# Altium project main.PrjPCB (part 2 of 2)

## Sheet sensors_in.SchDoc
size A4
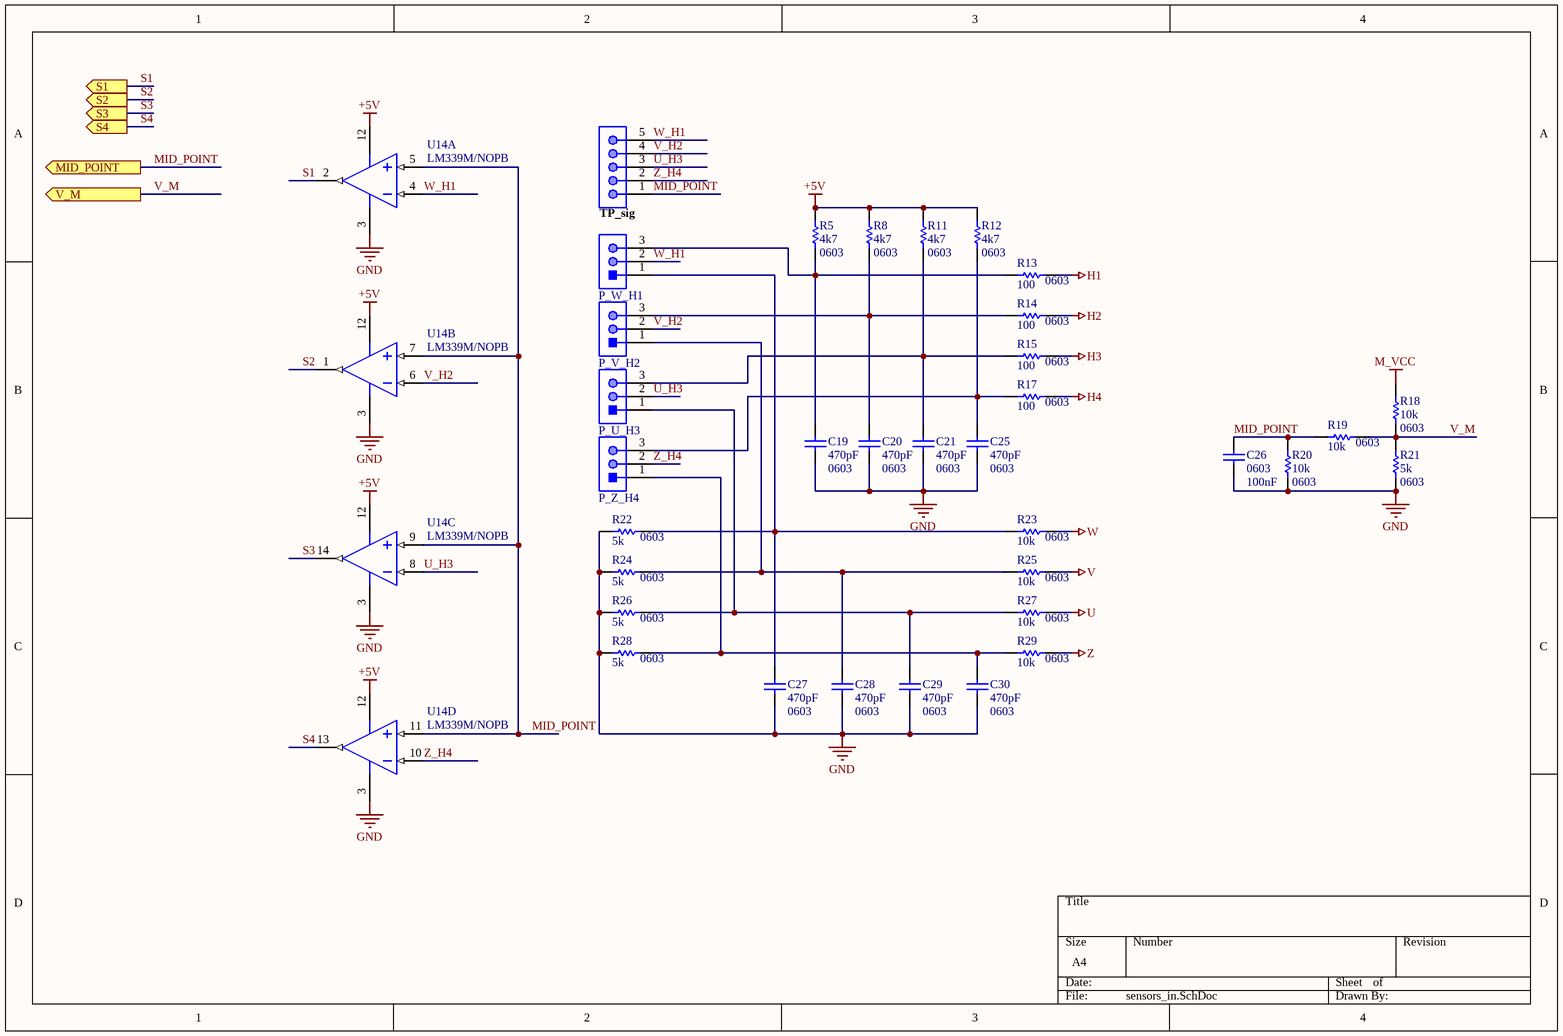
[diagram p5: sensors_in.SchDoc]

### Parts
C19  value 470pF  Case-EIA: 0603  [CAPC0603(1608)100_M]  (hidden comment: CAP 470pF 25V 0603(1608))
C20  value 470pF  Case-EIA: 0603  [CAPC0603(1608)100_M]  (hidden comment: CAP 470pF 25V 0603(1608))
C21  value 470pF  Case-EIA: 0603  [CAPC0603(1608)100_M]  (hidden comment: CAP 470pF 25V 0603(1608))
C25  value 470pF  Case-EIA: 0603  [CAPC0603(1608)100_M]  (hidden comment: CAP 470pF 25V 0603(1608))
C26  Case Code (Imperial): 0603  Capacitance: 100nF  [CAPC1608X90X35ML10T15]  (hidden comment: GRM188R71H104KA93D)
C27  value 470pF  Case-EIA: 0603  [CAPC0603(1608)100_M]  (hidden comment: CAP 470pF 25V 0603(1608))
C28  value 470pF  Case-EIA: 0603  [CAPC0603(1608)100_M]  (hidden comment: CAP 470pF 25V 0603(1608))
C29  value 470pF  Case-EIA: 0603  [CAPC0603(1608)100_M]  (hidden comment: CAP 470pF 25V 0603(1608))
C30  value 470pF  Case-EIA: 0603  [CAPC0603(1608)100_M]  (hidden comment: CAP 470pF 25V 0603(1608))
P_U_H3  61300311121  [61300311121]  (value not drawn)
P_V_H2  61300311121  [61300311121]  (value not drawn)
P_W_H1  61300311121  [61300311121]  (value not drawn)
P_Z_H4  61300311121  [61300311121]  (value not drawn)
R5  Resistance (Ohms): 4k7  Package Reference: 0603  [RESC1608X55X30ML15T20]  (hidden comment: RMCF0603FT10K0)
R8  Resistance (Ohms): 4k7  Package Reference: 0603  [RESC1608X55X30ML15T20]  (hidden comment: RMCF0603FT10K0)
R11  Resistance (Ohms): 4k7  Package Reference: 0603  [RESC1608X55X30ML15T20]  (hidden comment: RMCF0603FT10K0)
R12  Resistance (Ohms): 4k7  Package Reference: 0603  [RESC1608X55X30ML15T20]  (hidden comment: RMCF0603FT10K0)
R13  Resistance (Ohms): 100  Package Reference: 0603  [RESC1608X55X30ML15T20]  (hidden comment: RMCF0603FT10K0)
R14  Resistance (Ohms): 100  Package Reference: 0603  [RESC1608X55X30ML15T20]  (hidden comment: RMCF0603FT10K0)
R15  Resistance (Ohms): 100  Package Reference: 0603  [RESC1608X55X30ML15T20]  (hidden comment: RMCF0603FT10K0)
R17  Resistance (Ohms): 100  Package Reference: 0603  [RESC1608X55X30ML15T20]  (hidden comment: RMCF0603FT10K0)
R18  Resistance (Ohms): 10k  Package Reference: 0603  [RESC1608X55X30ML15T20]  (hidden comment: RMCF0603FT10K0)
R19  Resistance (Ohms): 10k  Package Reference: 0603  [RESC1608X55X30ML15T20]  (hidden comment: RMCF0603FT10K0)
R20  Resistance (Ohms): 10k  Package Reference: 0603  [RESC1608X55X30ML15T20]  (hidden comment: RMCF0603FT10K0)
R21  Resistance (Ohms): 5k  Package Reference: 0603  [RESC1608X55X30ML15T20]  (hidden comment: RMCF0603FT10K0)
R22  Resistance (Ohms): 5k  Package Reference: 0603  [RESC1608X55X30ML15T20]  (hidden comment: RMCF0603FT10K0)
R23  Resistance (Ohms): 10k  Package Reference: 0603  [RESC1608X55X30ML15T20]  (hidden comment: RMCF0603FT10K0)
R24  Resistance (Ohms): 5k  Package Reference: 0603  [RESC1608X55X30ML15T20]  (hidden comment: RMCF0603FT10K0)
R25  Resistance (Ohms): 10k  Package Reference: 0603  [RESC1608X55X30ML15T20]  (hidden comment: RMCF0603FT10K0)
R26  Resistance (Ohms): 5k  Package Reference: 0603  [RESC1608X55X30ML15T20]  (hidden comment: RMCF0603FT10K0)
R27  Resistance (Ohms): 10k  Package Reference: 0603  [RESC1608X55X30ML15T20]  (hidden comment: RMCF0603FT10K0)
R28  Resistance (Ohms): 5k  Package Reference: 0603  [RESC1608X55X30ML15T20]  (hidden comment: RMCF0603FT10K0)
R29  Resistance (Ohms): 10k  Package Reference: 0603  [RESC1608X55X30ML15T20]  (hidden comment: RMCF0603FT10K0)
TP_sig  PH2541-5-SPGRH-6-3  [PH2541-5-SPGRH-6-3_V]  (value not drawn)
U14  LM339M/NOPB  [D0014A_L]  (parts A,B,C,D of 4)

### Ports
MID_POINT (out), S1 (out), S2 (out), S3 (out), S4 (out), V_M (out)

### Nets
+5V: R5.2 R8.2 R11.2 R12.2 U14.12(GND)
GND: C19.1 C20.1 C21.1 C25.1 C26.1 C27.1 C28.1 C29.1 C30.1 R20.1 R21.1 R22.1 R24.1 R26.1 R28.1 U14.3(V+)
H1: R13.2
H2: R14.2
H3: R15.2
H4: R17.2
M_VCC: R18.2
U: R27.2
V: R25.2
W: R23.2
Z: R29.2
MID_POINT: C26.2 R19.1 R20.2 TP_sig.1 U14.5(IN1+) U14.7(IN2+) U14.9(IN3+) U14.11(IN4+) ; port MID_POINT
S1: U14.2(OUT1) ; port S1
S2: U14.1(OUT2) ; port S2
S3: U14.14(OUT3) ; port S3
S4: U14.13(OUT4) ; port S4
U_H3: P_U_H3.2 TP_sig.3 U14.8(IN3-)
V_H2: P_V_H2.2 TP_sig.4 U14.6(IN2-)
V_M: R18.1 R19.2 R21.2 ; port V_M
W_H1: P_W_H1.2 TP_sig.5 U14.4(IN1-)
Z_H4: P_Z_H4.2 TP_sig.2 U14.10(IN4-)
NetC19_2: C19.2 P_W_H1.3 R5.1 R13.1
NetC20_2: C20.2 P_V_H2.3 R8.1 R14.1
NetC21_2: C21.2 P_U_H3.3 R11.1 R15.1
NetC25_2: C25.2 P_Z_H4.3 R12.1 R17.1
NetC27_2: C27.2 P_W_H1.1 R22.2 R23.1
NetC28_2: C28.2 P_V_H2.1 R24.2 R25.1
NetC29_2: C29.2 P_U_H3.1 R26.2 R27.1
NetC30_2: C30.2 P_Z_H4.1 R28.2 R29.1

### Library data of the parts
C19-C21 C25 C27-C30 = CMP-1035-01670-1: CAP 470pF 25V ±5% 0603 (1608 Metric) Thickness 1mm SMD; Tolerance: Â±5%; Case-Metric: 1608; Rated Voltage: 25 V; Max Thickness: 1 mm; Technology: SMT
C26 = CMP-2100-03643-1: Chip Capacitor, 0.1 uF, +/- 10%, 50 V, -55 to 125 degC, 0603 (1608 Metric), RoHS, Tape and Reel; Manufacturer: Murata; Dielectric Material: Ceramic; Voltage Rating: 50V; Dielectric: X7R; Insulation Resistance: 10GR; Case Code (Metric): 1608; Lead Free: LeadFree; Depth: 0.8mm; Number of Pins: 2; Radiation Hardening: No; Case/Package: 0603; Manufacturer URL: http://www.murata.com/; Packaging: TapeandReel; Length: 1.6mm; Contact Plating: Tin; Datasheet URL: http://psearch.en.murata.com/capacitor/product/GRM188R71H104KA93%23.pdf; Tolerance: 10%; Min Operating Temperature: -55degC; RoHSCompliant: true; Voltage: 50V; Termination: SMD/SMT; Mount: SurfaceMount; Material: Ceramic; Package Quantity: 1; Height: 0.8mm; Thickness: 0.035inch; REACH SVHC: NoSVHC; Max Operating Temperature: 125degC; Width: 0.8mm; Package Reference: 0603; Voltage Rating (DC): 50V; Datasheet Version: 42675.0; Package Description: 2-Pin Surface Mount Device, Body 1.6 x 0.8 mm
P_U_H3 P_V_H2 P_W_H1 P_Z_H4 = CMP-1502-01062-1: THT Vertical Pin Header WR-PHD, Pitch 2.54 mm, Single Row, 3 pins; Manufacturer: Wurth Elektronik; Withstanding Voltage: 500VAC; Working Voltage: 250VAC; Rated Current: 3A; Pitch: 2.54mm; Pin Number: 3; Gender: Male; Contact Resistance: 20mOhm; Package Reference: 61300311121; Manufacturer URL: http://www.we-online.de; Datasheet URL: https://katalog.we-online.de/em/datasheet/6130xx11121.pdf; Operating Temperature: -40to105degC; Part Number: 61300311121; Orientation: Vertical; Packaging: Bag; Row Number: Single; Mounting Technology: THT; Publisher: WurthElektronik
R5 R8 R11-R15 R17-R29 = CMP-2000-06990-1: Chip Resistor, 10 KOhm, +/- 1%, 0.1 W, -55 to 155 degC, 0603 (1608 Metric), RoHS, Tape and Reel; Manufacturer: Stackpole-Electronics-Inc.; Temperature Coefficient: ±100ppm/°C; Power (Watts): 0.1W,1/10W; Package / Case: 0603(1608Metric); Datasheet Version: 01/2017; Features: AutomotiveAEC-Q200; Packaging: CutTape(CT); Series: RMCF; Tolerance: ±1%; Manufacturer URL: https://www.seielect.com/; Datasheet URL: https://www.seielect.com/Catalog/SEI-RMCF_RMCP.pdf; Supplier Device Package: 0603; Number of Terminations: 2; Family: ChipResistor-SurfaceMount; Mounting Technology: SurfaceMount; Package Description: 2-Pin Surface Mount Device, Body 1.55 x 0.8 mm; Operating Temperature: -55°C~155°C; Composition: ThickFilm; Category: Resistors
TP_sig = CMP-0261-00002-1: Male Header, Pitch 2.54mm, 5x1 Position, Mated Height 6mm, Tail Length 3mm; PartNumber: PH2541-5-SPGRH-6-3; ComponentLink1URL: http://www.suzhoupinchao.com/; PackageReference: PH2541-5-SPGRH-6-3; Mounting Technology: Through Hole; ComponentLink1Description: Manufacturer URL; PackageDescription: 5-Pin Male Header IDC, 2.54 x 12.7 mm Body, 2.54 mm Pitch
U14 = CMP-0055-00763-3: Low Power Low Offset Voltage Quad Comparator, 14-pin Narrow SOIC, Pb-Free; Manufacturer: Texas Instruments; PackageTopMarking: NSUZXYTTE#*LM339M; CompType: Amplifiers; PowerWise: N; Code_JEDEC: MS-012AB; RoHS: Y; Package Reference: D0014A; Code_IPC: SOIC127P600-14; ComponentLink1URL: http://www.ti.com/general/docs/lit/getliterature.tsp?genericPartNumber=LM339-N&fileType=pdf; PackageDescription: Molded Package S.O., .150in Wide, 14 Lead; PinCount: 14; ComponentLink1Description: Datasheet URL; PartId: 1

## Nets that join several sheets
+5V: power (7 pins), driver (8 pins), ADC (C5.2 L2.1 U2.13), in_buf (6 pins), sensors_in (5 pins)
+12V: power (12V_source.2), driver (8 pins), ADC (C3.2 L1.1)
GND: power (13 pins), driver (36 pins), ADC (9 pins), in_buf (18 pins), sensors_in (16 pins)
H1: power (SENSORs.3), sensors_in (R13.2)
H2: power (SENSORs.2), sensors_in (R14.2)
H3: power (SENSORs.1), sensors_in (R15.2)
H4: power (EXTRA.1), sensors_in (R17.2)
M_VCC: power (5 pins), driver (5 pins), sensors_in (R18.2)
U: power (MOTOR.1), driver (6 pins), sensors_in (R27.2)
V: power (MOTOR.2), driver (6 pins), sensors_in (R25.2)
W: power (MOTOR.3), driver (6 pins), sensors_in (R23.2)
Z: power (EXTRA.2), driver (6 pins), sensors_in (R29.2)
CS: ADC (U2.1), in_buf (SPI.2 U8.12)
DIN: ADC (U2.2), in_buf (SPI.4 U8.14)
DOUT: ADC (U2.14), in_buf (SPI.3 U8.13)
I_ACS: driver (U16.7), ADC (Analog_selection.1)
I_INA: driver (R32.2 U17.1), ADC (Analog_selection.3)
M_EN: driver (13 pins), in_buf (U3.18 U10.20)
MID_POINT: ADC (Analog_selection.7), sensors_in (8 pins)
S1: in_buf (Sensors_Signals.2), sensors_in (U14.2)
S2: in_buf (Sensors_Signals.4), sensors_in (U14.1)
S3: in_buf (Sensors_Signals.6), sensors_in (U14.14)
S4: in_buf (Sensors_Signals.8), sensors_in (U14.13)
SCLK: ADC (U2.16), in_buf (SPI.5 U8.15)
U_H: driver (R43.2 U11.1 U_H_in.1), in_buf (U3.15)
U_L: driver (R44.2 U11.4 U_L_in.1), in_buf (U3.14)
V_H: driver (R41.2 U5.9 V_H_in.1), in_buf (U3.17)
V_L: driver (R42.2 U5.12 V_L_in.1), in_buf (U3.16)
V_M: ADC (Analog_selection.5), sensors_in (R18.1 R19.2 R21.2)
W_H: driver (R39.2 U5.4 W_H_in.1), in_buf (U3.20)
Z_H: driver (R45.2 U11.12 Z_H_in.1), in_buf (U3.13)
Z_L: driver (R46.2 U11.9 Z_L_in.1), in_buf (U3.12)